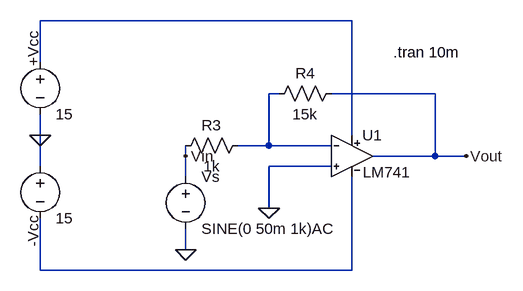
[diagram p0: schematic inverter.asc]
inverter.asc, the LTspice schematic file:
Version 4
SHEET 1 880 680
WIRE 144 -48 -336 -48
WIRE -336 16 -336 -48
WIRE 32 64 16 64
WIRE 272 64 112 64
WIRE -336 128 -336 96
WIRE 144 128 144 -48
WIRE 16 144 16 64
WIRE 16 144 -32 144
WIRE 112 144 16 144
WIRE -112 160 -112 144
WIRE 272 160 272 64
WIRE 272 160 176 160
WIRE 320 160 272 160
WIRE -336 176 -336 128
WIRE 112 176 16 176
WIRE -112 192 -112 160
WIRE 16 240 16 176
WIRE -112 304 -112 272
WIRE -336 336 -336 256
WIRE 144 336 144 192
WIRE 144 336 -336 336
FLAG -112 304 0
FLAG 16 240 0
FLAG -336 128 0
FLAG 320 160 Vout
FLAG -112 160 Vin
SYMBOL LM741 144 96 R0
SYMATTR InstName U1
SYMBOL voltage -336 160 R0
WINDOW 0 -11 92 VRight 2
SYMATTR InstName -Vcc
SYMATTR Value 15
SYMBOL voltage -336 0 R0
WINDOW 0 -11 22 VLeft 2
WINDOW 123 0 0 Left 2
WINDOW 39 0 0 Left 2
SYMATTR InstName +Vcc
SYMATTR Value 15
SYMBOL voltage -112 176 R0
WINDOW 123 0 0 Left 2
WINDOW 39 0 0 Left 2
SYMATTR InstName Vs
SYMATTR Value SINE(0 50m 1k)AC
SYMBOL res -16 128 R90
WINDOW 0 0 56 VBottom 2
WINDOW 3 32 56 VTop 2
SYMATTR InstName R3
SYMATTR Value 1k
SYMBOL res 128 48 R90
WINDOW 0 0 56 VBottom 2
WINDOW 3 32 56 VTop 2
SYMATTR InstName R4
SYMATTR Value 15k
TEXT 208 0 Left 2 !.tran 10m

The netlist it stands for:
* inverter.asc
XU1 0 N002 N001 N003 Vout LM741  ; pins In+ In- V+ V- OUT
V§-Vcc 0 N003 15
V§+Vcc N001 0 15
Vs Vin 0 SINE(0 50m 1k)AC
R3 N002 Vin 1k
R4 Vout N002 15k
.tran 10m
.lib LM741.lib
.backanno
.end